# Altium schematic sheet FLASH MEMORY.SchDoc
size A4; SheetNumber: 20; SheetTotal: 26
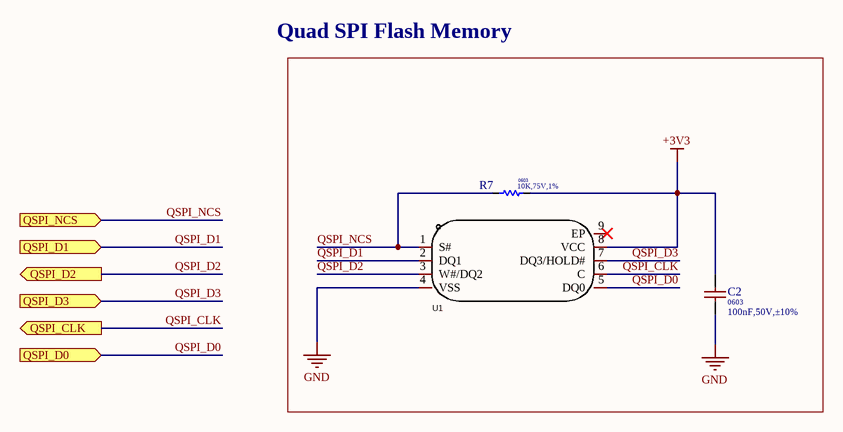
[diagram p0: FLASH MEMORY.SchDoc]

## Parts
C2  value 100nF,50V,±10%  Package: 0603  [C0603]  (hidden comment: CL10B104KB8NNNC)
R7  Package: 0603  [R0603]  (hidden comment: 10K,75V,1%)
U1  MT25QL128ABA1EW9-0SIT  [WSON-8(6x8)]  (value not drawn)

## Ports
QSPI_CLK (out), QSPI_D0 (in), QSPI_D1 (in), QSPI_D2 (out), QSPI_D3 (in), QSPI_NCS (in)

## Nets
+3V3: C2.2 R7.2 U1.8(VCC)
GND: C2.1 U1.4(VSS)
QSPI_CLK: U1.6(C) ; port QSPI_CLK
QSPI_D0: U1.5(DQ0) ; port QSPI_D0
QSPI_D1: U1.2(DQ1) ; port QSPI_D1
QSPI_D2: U1.3(W#/DQ2) ; port QSPI_D2
QSPI_D3: U1.7(DQ3/HOLD#) ; port QSPI_D3
QSPI_NCS: R7.1 U1.1(S#) ; port QSPI_NCS

Not connected (* = marked no-connect by the designer): U1 9(EP)*

## Notes on the sheet
- Quad SPI Flash Memory

## Library data of the parts
C2 = CL10B104KB8NNNC: 50V 100nF X7R ±10% 0603 Multilayer Ceramic Capacitors MLCC - SMD/SMT ROHS; Manufacturer: SAMSUNG; Max Operating Temp: 125; Min Operating Temp: -55; MPN: CL10B104KB8NNNC; Datasheet: https://datasheet.lcsc.com/lcsc/2304140030_Samsung-Electro-Mechanics-CL10B104KB8NNNC_C1591.pdf; LCSC: C1591
R7 = 0603WAF1002T5E: 100mW Thick Film Resistors ±100ppm/℃ ±1% 10kΩ 0603 Chip Resistor - Surface Mount ROHS; Manufacturer: UNI-ROYAL(Uniroyal Elec); Max Operating Temp: 155℃; Min Operating Temp: -55℃; MPN: 0603WAF1002T5E; Datasheet: https://datasheet.lcsc.com/szlcsc/Uniroyal-Elec-0603WAF1002T5E_C25804.pdf; Value: 10K,75V,1%; LCSC: C25804
U1 = MT25QL128ABA1EW9-0SIT: WSON-8(6x8) NOR FLASH ROHS; Manufacturer: micron(镁光); LCSC: C524863; MPN: MT25QL128ABA1EW9-0SIT; Package Reference: WSON-8(6x8); Datasheet: https://atta.szlcsc.com/upload/public/pdf/source/20190912/C427722_3FD902587F3F6B4A9D46B2B844CAD1C1.pdf